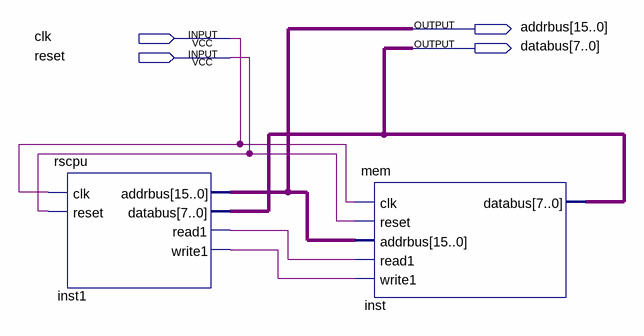
[diagram p0: schematic sheet]
// Quartus schematic rscomp.bdf as structural Verilog: 2 symbols, 4 pins
module rscomp (
  input  clk,
  input  reset,
  output [15:0] addrbus,
  output [7:0] databus
);

  wire inst1_read1, inst1_write1;

  rscpu inst1 (
    .clk(clk), .reset(reset), .addrbus(addrbus), .read1(inst1_read1), .write1(inst1_write1), .databus(databus));
  mem inst (.clk(clk), .reset(reset), .addrbus(addrbus), .read1(inst1_read1), .write1(inst1_write1), .databus(databus));
endmodule
